# Altium project Project_ProgAdapter_v1.PrjPCB
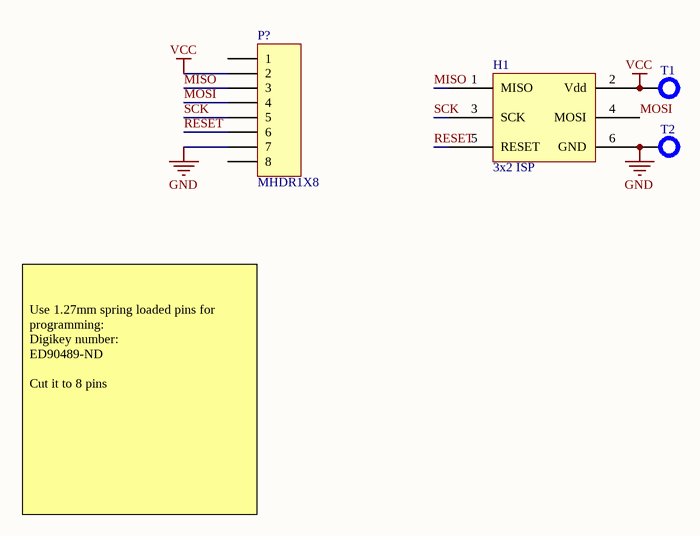
[diagram p0: Schematic.ProgAdapter_v1.SchDoc]
1 sheet, 4 parts. Net scope: global (net labels, ports and power ports of the same name join across sheets).
Board file: PCB_ProgAdapter_v1.PcbDoc

## Sheet Schematic.ProgAdapter_v1.SchDoc: SensorTape ISP Programming adapter
size B; Author: Artem Dementyev; Revision: 1.0

### Parts
H1  3x2 ISP  [3x2 ISP]
P?  MHDR1X8  [MHDR1X8]
T1  Test point small  [Test point small]  (value not drawn)
T2  Test point small  [Test point small]  (value not drawn)

### Nets
GND: H1.6(GND) P?.7 T2.0
VCC: H1.2(Vdd) P?.2 T1.0
MISO: H1.1(MISO) P?.3
MOSI: H1.4(MOSI) P?.4
RESET: H1.5(RESET) P?.6
SCK: H1.3(SCK) P?.5

Not connected (* = marked no-connect by the designer): P? 1 8

### Notes on the sheet
- Use 1.27mm spring loaded pins for programming:
  Digikey number:
  ED90489-ND
  Cut it to 8 pins
- Title
- Designed by
- Ver
- Date:
- Time:

### Library data of the parts
P? = MHDR1X8: Header, 8-Pin; LatestRevisionDate: 17-Jul-2002; LatestRevisionNote: Re-released for DXP Platform.; Publisher: Altium Limited
T1 T2 = Test point small: digikey number: 5000K-ND